# EAGLE design osh_bga_test (EAGLE 8.0.0)

## Sheet 1 of 4
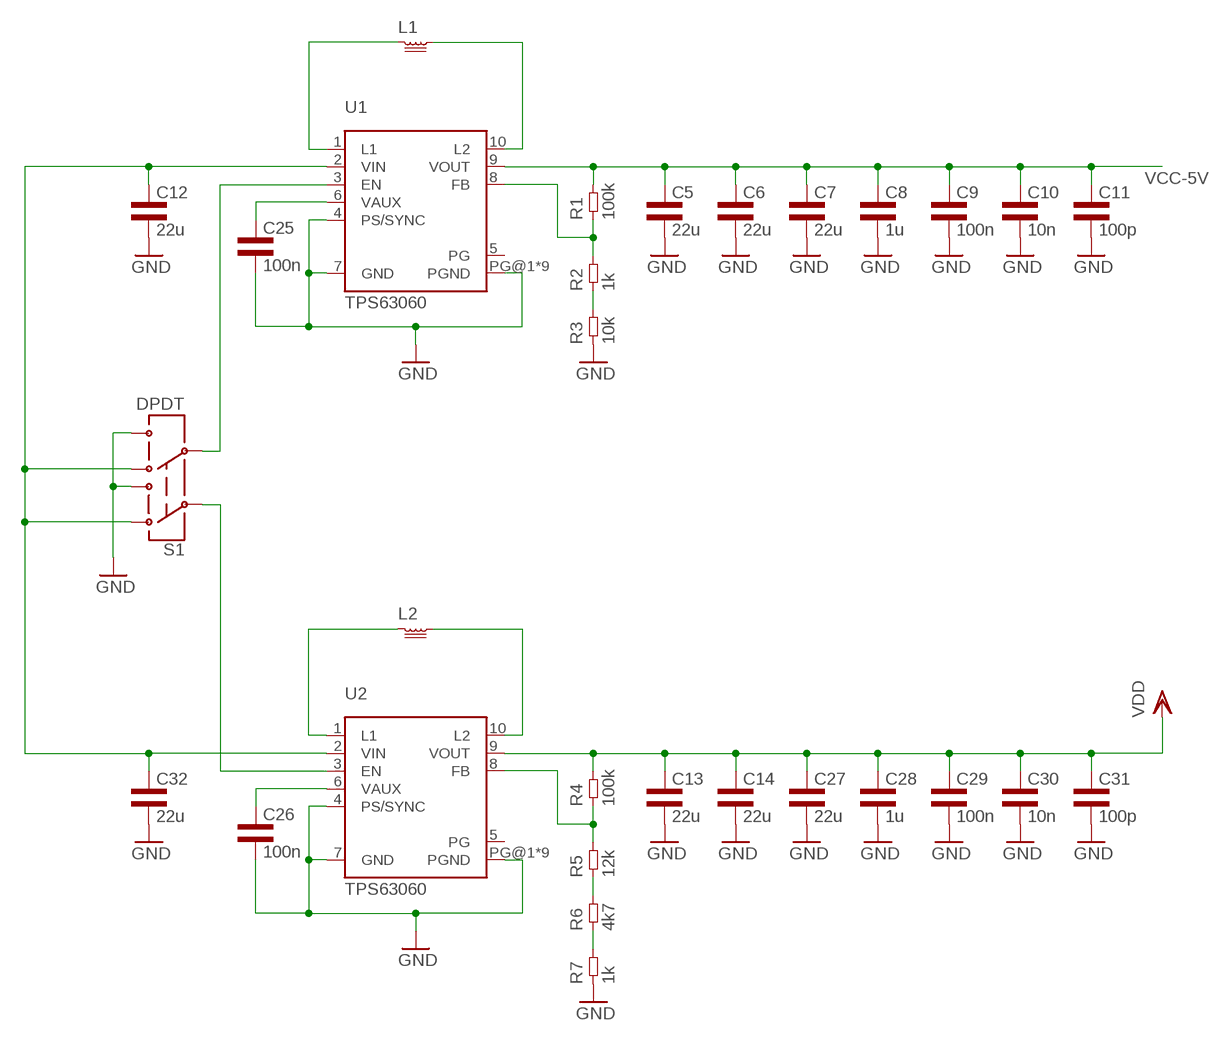
[diagram p0: schematic, sheet 1]

### Parts
C5  22u  CAP1206L3  [1206L3]
C6  22u  CAP1206L3  [1206L3]
C7  22u  CAP1206L3  [1206L3]
C8  1u  CAP0805L3  [0805L3]
C9  100n  CAP0603L3  [0603L3]
C10  10n  CAP0603L3  [0603L3]
C11  100p  CAP0603L3  [0603L3]
C12  22u  CAP1206L3  [1206L3]
C13  22u  CAP1206L3  [1206L3]
C14  22u  CAP1206L3  [1206L3]
C25  100n  CAP0603L3  [0603L3]
C26  100n  CAP0603L3  [0603L3]
C27  22u  CAP1206L3  [1206L3]
C28  1u  CAP0805L3  [0805L3]
C29  100n  CAP0603L3  [0603L3]
C30  10n  CAP0603L3  [0603L3]
C31  100p  CAP0603L3  [0603L3]
C32  22u  CAP1206L3  [1206L3]
L1  INDUCTORSRP4020  [SRP4020]
L2  INDUCTORSRP4020  [SRP4020]
R1  100k  RES0603L3  [0603L3]
R2  1k  RES0603L3  [0603L3]
R3  10k  RES0603L3  [0603L3]
R4  100k  RES0603L3  [0603L3]
R5  12k  RES0603L3  [0603L3]
R6  4k7  RES0603L3  [0603L3]
R7  1k  RES0603L3  [0603L3]
S1  DPDT  SWITCH-DPDTAYZ0202  [AYZ0202]
U1  TPS63060  [S-PWSON-N10]
U2  TPS63060  [S-PWSON-N10]

### Nets
GND: C5.2 C6.2 C7.2 C8.2 C9.P$2 C10.P$2 C11.P$2 C12.2 C13.2 C14.2 C25.P$2 C26.P$2 C27.2 C28.2 C29.P$2 C30.P$2 C31.P$2 C32.2 R3.P$1 R7.P$1 S1.3 S1.6 U1.4(PS/SYNC) U1.7(GND) U1.PG@1(PGND) U1.PG@2(PGND) U1.PG@3(PGND) U1.PG@4(PGND) U1.PG@5(PGND) U1.PG@6(PGND) U1.PG@7(PGND) U1.PG@8(PGND) U1.PG@9(PGND) U2.4(PS/SYNC) U2.7(GND) U2.PG@1(PGND) U2.PG@2(PGND) U2.PG@3(PGND) U2.PG@4(PGND) U2.PG@5(PGND) U2.PG@6(PGND) U2.PG@7(PGND) U2.PG@8(PGND) U2.PG@9(PGND) ; also sheet 2,3
N$1: L1.1 U1.1(L1)
N$2: L1.2 U1.10(L2)
N$3: R1.P$1 R2.P$2 U1.8(FB)
N$4: S1.5 U1.3(EN)
N$5: L2.1 U2.1(L1)
N$6: L2.2 U2.10(L2)
N$7: S1.2 U2.3(EN)
N$8: R2.P$1 R3.P$2
N$9: R4.P$1 R5.P$2 U2.8(FB)
N$10: R5.P$1 R6.P$2
N$11: R6.P$1 R7.P$2
N$12: C25.P$1 U1.6(VAUX)
N$13: C26.P$1 U2.6(VAUX)
VBAT: C12.1 C32.1 S1.1 S1.4 U1.2(VIN) U2.2(VIN)
VCC-5V: C5.1 C6.1 C7.1 C8.1 C9.P$1 C10.P$1 C11.P$1 R1.P$2 U1.9(VOUT)
VDD: C13.1 C14.1 C27.1 C28.1 C29.P$1 C30.P$1 C31.P$1 R4.P$2 U2.9(VOUT) ; also sheet 2,3
Unconnected: U1.5(PG) U2.5(PG)

## Sheet 2 of 4
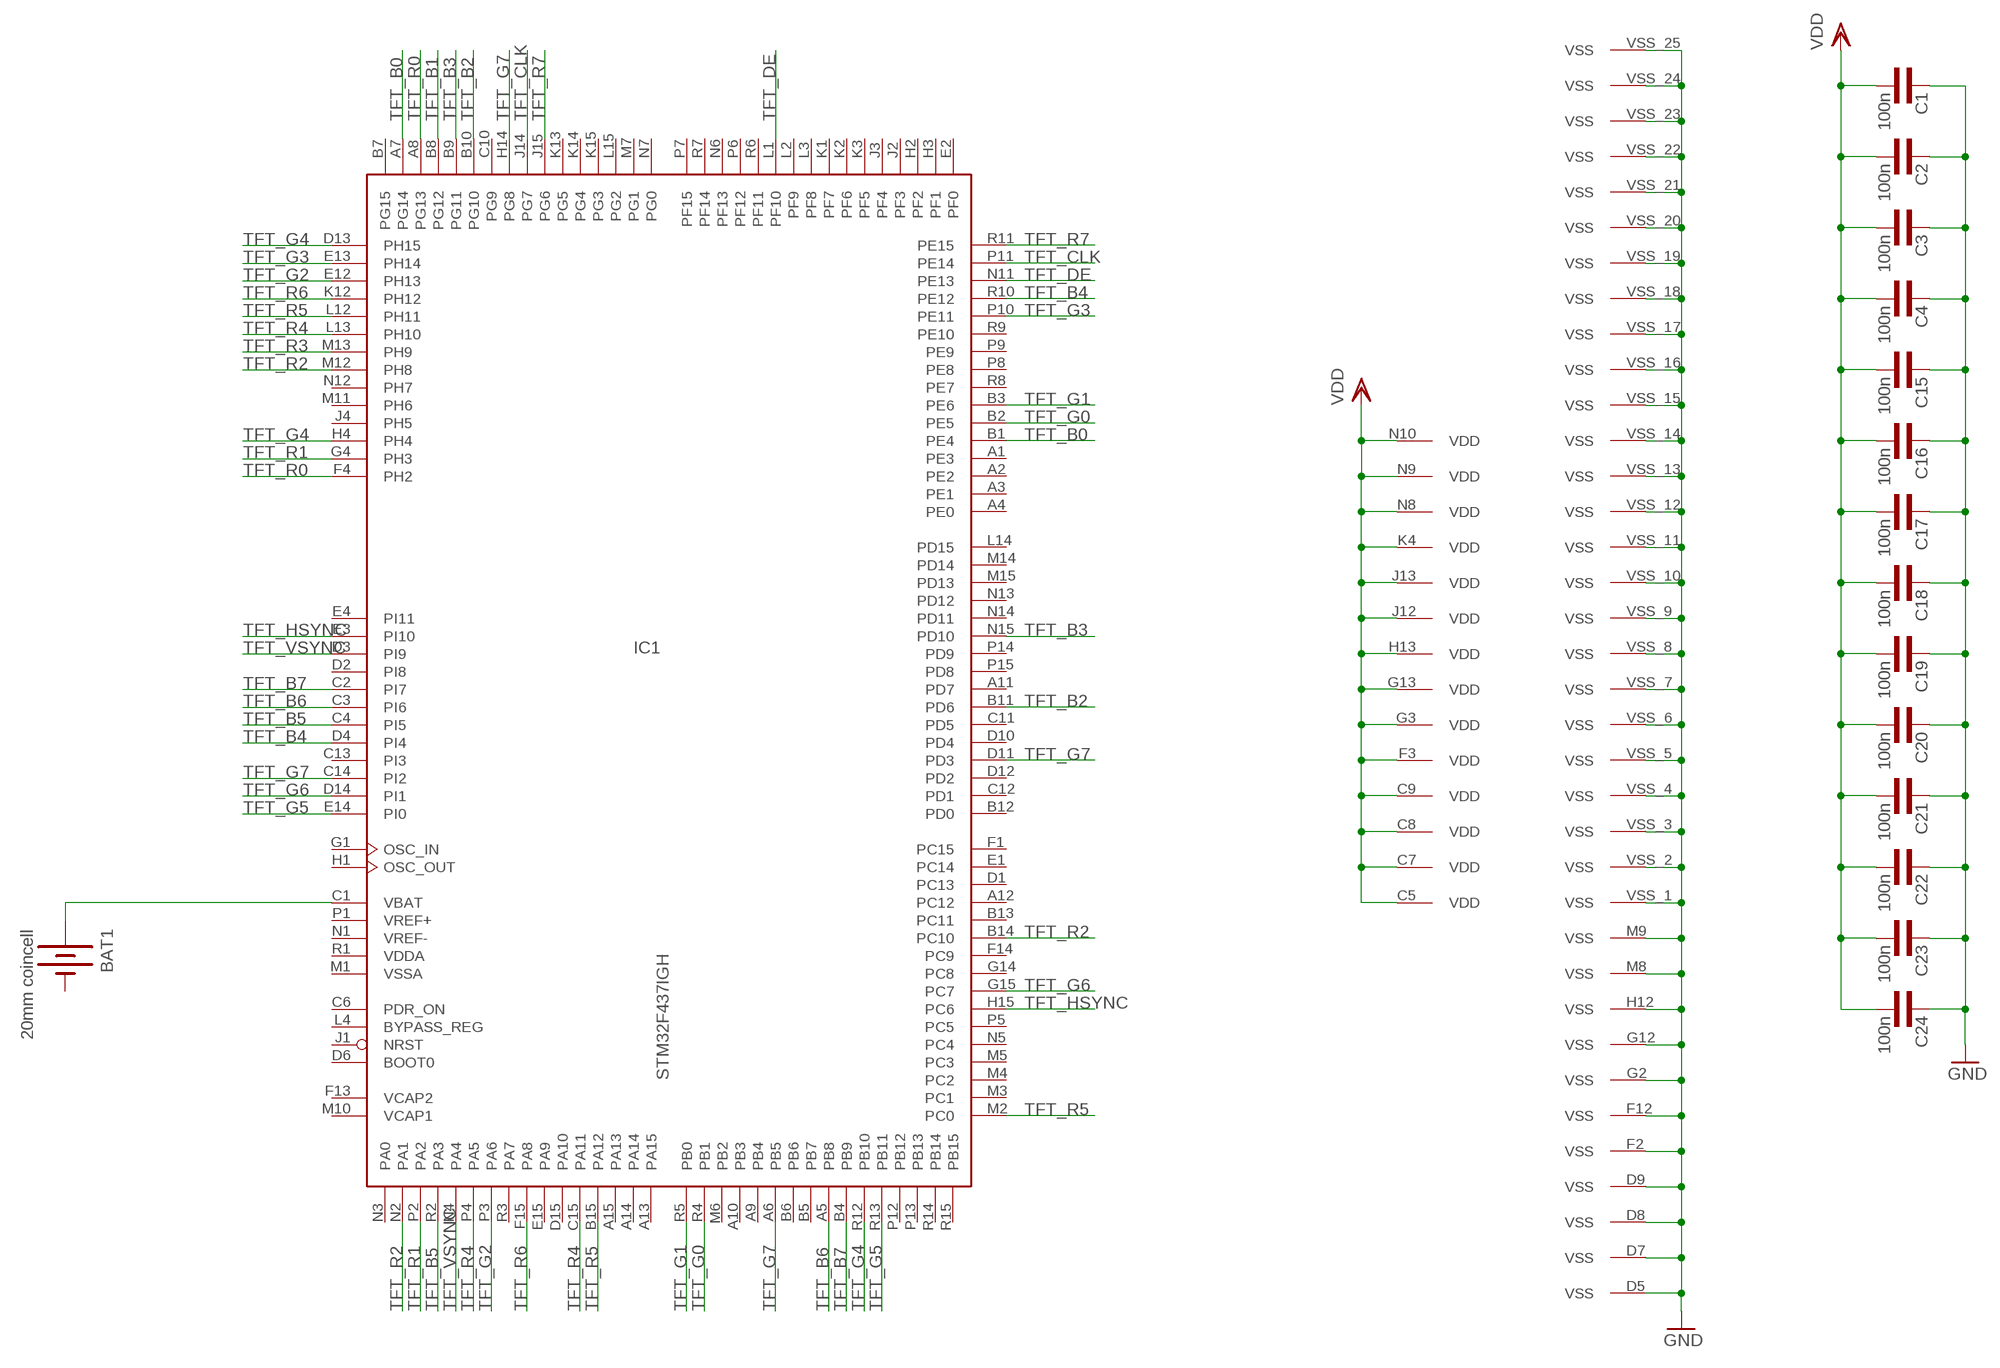
[diagram p1: schematic, sheet 2]

### Parts
BAT1  20mm coincell  BATTERY20MM_4LEGS  [BATTCON_20MM_4LEGS]
C1  100n  CAP0402L3  [0402L3]
C2  100n  CAP0402L3  [0402L3]
C3  100n  CAP0402L3  [0402L3]
C4  100n  CAP0402L3  [0402L3]
C15  100n  CAP0402L3  [0402L3]
C16  100n  CAP0402L3  [0402L3]
C17  100n  CAP0402L3  [0402L3]
C18  100n  CAP0402L3  [0402L3]
C19  100n  CAP0402L3  [0402L3]
C20  100n  CAP0402L3  [0402L3]
C21  100n  CAP0402L3  [0402L3]
C22  100n  CAP0402L3  [0402L3]
C23  100n  CAP0402L3  [0402L3]
C24  100n  CAP0402L3  [0402L3]
IC1  STM32F437IGH  [UFBGA176+25]

### Nets
GND: C1.P$1 C2.P$1 C3.P$1 C4.P$1 C15.P$1 C16.P$1 C17.P$1 C18.P$1 C19.P$1 C20.P$1 C21.P$1 C22.P$1 C23.P$1 C24.P$1 IC1.D5(VSS) IC1.D7(VSS) IC1.D8(VSS) IC1.D9(VSS) IC1.F2(VSS) IC1.F12(VSS) IC1.G2(VSS) IC1.G12(VSS) IC1.H12(VSS) IC1.M8(VSS) IC1.M9(VSS) IC1.VSS_1(VSS) IC1.VSS_2(VSS) IC1.VSS_3(VSS) IC1.VSS_4(VSS) IC1.VSS_5(VSS) IC1.VSS_6(VSS) IC1.VSS_7(VSS) IC1.VSS_8(VSS) IC1.VSS_9(VSS) IC1.VSS_10(VSS) IC1.VSS_11(VSS) IC1.VSS_12(VSS) IC1.VSS_13(VSS) IC1.VSS_14(VSS) IC1.VSS_15(VSS) IC1.VSS_16(VSS) IC1.VSS_17(VSS) IC1.VSS_18(VSS) IC1.VSS_19(VSS) IC1.VSS_20(VSS) IC1.VSS_21(VSS) IC1.VSS_22(VSS) IC1.VSS_23(VSS) IC1.VSS_24(VSS) IC1.VSS_25(VSS) ; also sheet 1,3
N$14: BAT1.1(+) IC1.C1(VBAT)
TFT_B0: IC1.A7(PG14) IC1.B1(PE4) ; also sheet 3
TFT_B1: IC1.B8(PG12) ; also sheet 3
TFT_B2: IC1.B10(PG10) IC1.B11(PD6) ; also sheet 3
TFT_B3: IC1.B9(PG11) IC1.N15(PD10) ; also sheet 3
TFT_B4: IC1.D4(PI4) IC1.R10(PE12) ; also sheet 3
TFT_B5: IC1.C4(PI5) IC1.R2(PA3) ; also sheet 3
TFT_B6: IC1.A5(PB8) IC1.C3(PI6) ; also sheet 3
TFT_B7: IC1.B4(PB9) IC1.C2(PI7) ; also sheet 3
TFT_CLK: IC1.J14(PG7) IC1.P11(PE14) ; also sheet 3
TFT_DE: IC1.L1(PF10) IC1.N11(PE13) ; also sheet 3
TFT_G0: IC1.B2(PE5) IC1.R4(PB1) ; also sheet 3
TFT_G1: IC1.B3(PE6) IC1.R5(PB0) ; also sheet 3
TFT_G2: IC1.E12(PH13) IC1.P3(PA6) ; also sheet 3
TFT_G3: IC1.E13(PH14) IC1.P10(PE11) ; also sheet 3
TFT_G4: IC1.D13(PH15) IC1.H4 IC1.R12(PB10) ; also sheet 3
TFT_G5: IC1.E14(PI0) IC1.R13(PB11) ; also sheet 3
TFT_G6: IC1.D14(PI1) IC1.G15(PC7) ; also sheet 3
TFT_G7: IC1.A6(PB5) IC1.C14(PI2) IC1.D11(PD3) IC1.H14(PG8) ; also sheet 3
TFT_HSYNC: IC1.E3(PI10) IC1.H15(PC6) ; also sheet 3
TFT_R0: IC1.A8(PG13) IC1.F4(PH2) ; also sheet 3
TFT_R1: IC1.G4(PH3) IC1.P2(PA2) ; also sheet 3
TFT_R2: IC1.B14(PC10) IC1.M12(PH8) IC1.N2(PA1) ; also sheet 3
TFT_R3: IC1.M13(PH9) ; also sheet 3
TFT_R4: IC1.C15(PA11) IC1.L13(PH10) IC1.P4(PA5) ; also sheet 3
TFT_R5: IC1.B15(PA12) IC1.L12(PH11) IC1.M2(PC0) ; also sheet 3
TFT_R6: IC1.F15(PA8) IC1.K12(PH12) ; also sheet 3
TFT_R7: IC1.J15(PG6) IC1.R11(PE15) ; also sheet 3
TFT_VSYNC: IC1.D3(PI9) IC1.N4(PA4) ; also sheet 3
VDD: C1.P$2 C2.P$2 C3.P$2 C4.P$2 C15.P$2 C16.P$2 C17.P$2 C18.P$2 C19.P$2 C20.P$2 C21.P$2 C22.P$2 C23.P$2 C24.P$2 IC1.C5(VDD) IC1.C7(VDD) IC1.C8(VDD) IC1.C9(VDD) IC1.F3(VDD) IC1.G3(VDD) IC1.G13(VDD) IC1.H13(VDD) IC1.J12(VDD) IC1.J13(VDD) IC1.K4(VDD) IC1.N8(VDD) IC1.N9(VDD) IC1.N10(VDD) ; also sheet 1,3
Unconnected: IC1.A1(PE3) IC1.A2(PE2) IC1.A3(PE1) IC1.A4(PE0) IC1.A9(PB4) IC1.A10(PB3) IC1.A11(PD7) IC1.A12(PC12) IC1.A13(PA15) IC1.A14 IC1.A15(PA13) IC1.B5(PB7) IC1.B6 IC1.B7(PG15) IC1.B12(PD0) IC1.B13(PC11) IC1.C6(PDR_ON) IC1.C10(PG9) IC1.C11(PD5) IC1.C12(PD1) IC1.C13(PI3) IC1.D1(PC13) IC1.D2(PI8) IC1.D6(BOOT0) IC1.D10(PD4) IC1.D12(PD2) IC1.D15(PA10) IC1.E1(PC14) IC1.E2(PF0) IC1.E4(PI11) IC1.E15(PA9) IC1.F1(PC15) IC1.F14(PC9) IC1.G1(OSC_IN) IC1.G14(PC8) IC1.H1(OSC_OUT) IC1.H2(PF2) IC1.H3(PF1) IC1.J1(NRST) IC1.J2(PF3) IC1.J3(PF4) IC1.J4(PH5) IC1.K1(PF7) IC1.K2(PF6) IC1.K3(PF5) IC1.K13(PG5) IC1.K14(PG4) IC1.K15(PG3) IC1.L2(PF9) IC1.L3(PF8) IC1.L4(BYPASS_REG) IC1.L14(PD15) IC1.L15(PG2) IC1.M3(PC1) IC1.M4(PC2) IC1.M5(PC3) IC1.M6(PB2) IC1.M7(PG1) IC1.M11(PH6) IC1.M14(PD14) IC1.M15(PD13) IC1.N3(PA0) IC1.N5(PC4) IC1.N6(PF13) IC1.N7(PG0) IC1.N12(PH7) IC1.N13(PD12) IC1.N14(PD11) IC1.P5(PC5) IC1.P6(PF12) IC1.P7(PF15) IC1.P8(PE8) IC1.P9(PE9) IC1.P12(PB12) IC1.P13(PB13) IC1.P14(PD9) IC1.P15(PD8) IC1.R3(PA7) IC1.R6(PF11) IC1.R7(PF14) IC1.R8(PE7) IC1.R9(PE10) IC1.R14(PB14) IC1.R15(PB15)

## Sheet 3 of 4: TFT
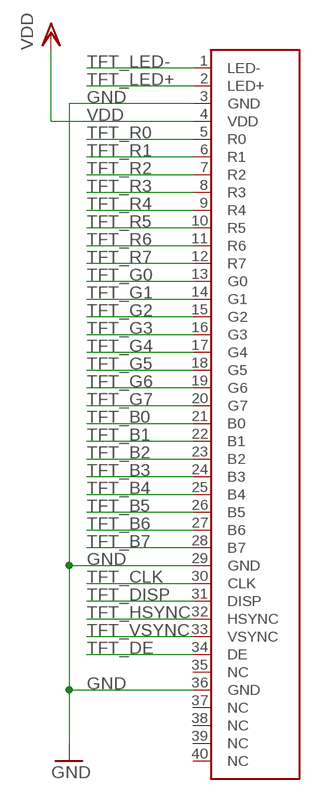
[diagram p2: schematic, sheet 3]

### Parts
CON1  NH-4.3  [FPC-40]

### Nets
GND: CON1.3(GND) CON1.29(GND) CON1.36(GND) ; also sheet 1,2
TFT_B0: CON1.21(B0) ; also sheet 2
TFT_B1: CON1.22(B1) ; also sheet 2
TFT_B2: CON1.23(B2) ; also sheet 2
TFT_B3: CON1.24(B3) ; also sheet 2
TFT_B4: CON1.25(B4) ; also sheet 2
TFT_B5: CON1.26(B5) ; also sheet 2
TFT_B6: CON1.27(B6) ; also sheet 2
TFT_B7: CON1.28(B7) ; also sheet 2
TFT_CLK: CON1.30(CLK) ; also sheet 2
TFT_DE: CON1.34(DE) ; also sheet 2
TFT_DISP: CON1.31(DISP)
TFT_G0: CON1.13(G0) ; also sheet 2
TFT_G1: CON1.14(G1) ; also sheet 2
TFT_G2: CON1.15(G2) ; also sheet 2
TFT_G3: CON1.16(G3) ; also sheet 2
TFT_G4: CON1.17(G4) ; also sheet 2
TFT_G5: CON1.18(G5) ; also sheet 2
TFT_G6: CON1.19(G6) ; also sheet 2
TFT_G7: CON1.20(G7) ; also sheet 2
TFT_HSYNC: CON1.32(HSYNC) ; also sheet 2
TFT_LED+: CON1.2(LED+)
TFT_LED-: CON1.1(LED-)
TFT_R0: CON1.5(R0) ; also sheet 2
TFT_R1: CON1.6(R1) ; also sheet 2
TFT_R2: CON1.7(R2) ; also sheet 2
TFT_R3: CON1.8(R3) ; also sheet 2
TFT_R4: CON1.9(R4) ; also sheet 2
TFT_R5: CON1.10(R5) ; also sheet 2
TFT_R6: CON1.11(R6) ; also sheet 2
TFT_R7: CON1.12(R7) ; also sheet 2
TFT_VSYNC: CON1.33(VSYNC) ; also sheet 2
VDD: CON1.4(VDD) ; also sheet 1,2
Unconnected: CON1.35(NC) CON1.37(NC) CON1.38(NC) CON1.39(NC) CON1.40(NC)

## Sheet 4 of 4: JTAG
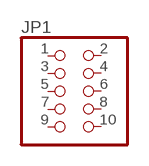
[diagram p3: schematic, sheet 4]

### Parts
JP1  PINHD-2X5  [2X05]
Unconnected: JP1.1 JP1.2 JP1.3 JP1.4 JP1.5 JP1.6 JP1.7 JP1.8 JP1.9 JP1.10

## Power pins joined to a net without a drawn wire
-: BAT1.2(-)
GND: IC1.M10(VCAP1)
VCAP2: IC1.F13(VCAP2)
VDDA: IC1.R1(VDDA)
VREF+: IC1.P1(VREF+)
VREF-: IC1.N1(VREF-)
VSSA: IC1.M1(VSSA)

## Library data of the parts
BAT1 = SparkFun-Electromechanical:BATTERY: Battery Holders Various common sizes : AA, AAA, 20mm coin cell and 12mm coin cell. 20MM_4LEGS, BATT-10373; PROD_ID: BATT-10373
C1-C32 = common:CAP
CON1 = common:NH-4.3
IC1 = micro-stm_v3:STM32F437I*H: ARM 32-bit Cortex™-M3 CPU 180 MHz maximum frequency 1024 to 2048 Kbytes of Flash memory 256 kbytes of SRAM 140 GPIOs 1.8 to 3.6 V application supply
JP1 = pinhead:PINHD-2X5: PIN HEADER
L1 L2 = common:INDUCTOR
R1-R7 = common:RES
S1 = SparkFun-Electromechanical:SWITCH-DPDT: DPDT Version of the COM-00597; PROD_ID: SWCH-08179
U1 U2 = common:TPS63060: Buck-Boost converter with 2A switching current. 2A/1A output current @ 5V Buck, 1.3A @ 5V Boost (Vin > 4V).Auto transition between Buck and Boost. VIN = 2.5V - 12V VOUT = 2.5V - 8V Load disconnect during shutdown Overtemp Protection Overvoltage Protection Fixed Frequency @ 2.4MHz with Sync possible For use in Lithium battery applications; FREQ: 2.4MHz; IOUT_MAX: 2A; VIN_MAX: 12V; VIN_MIN: 2.5V; VOUT_MAX: 8V; VOUT_MIN: 2.5V

## Board
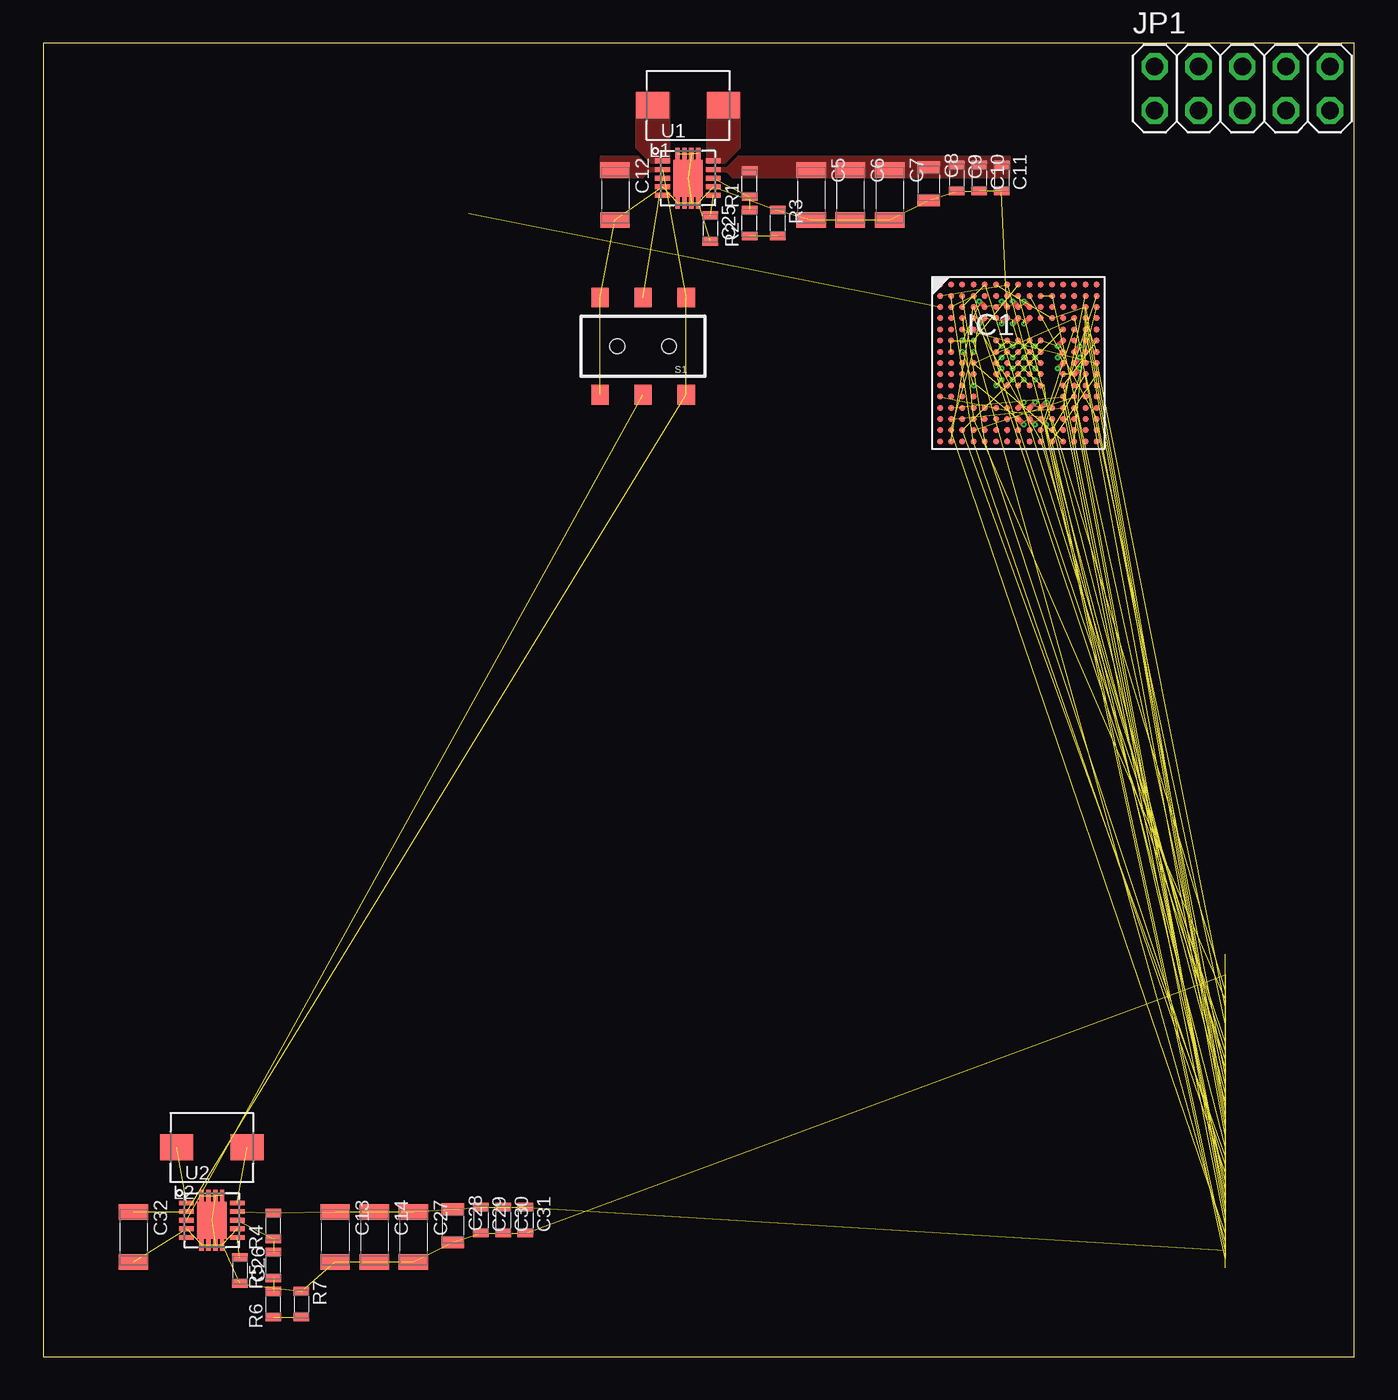
[diagram p4: board, top side]
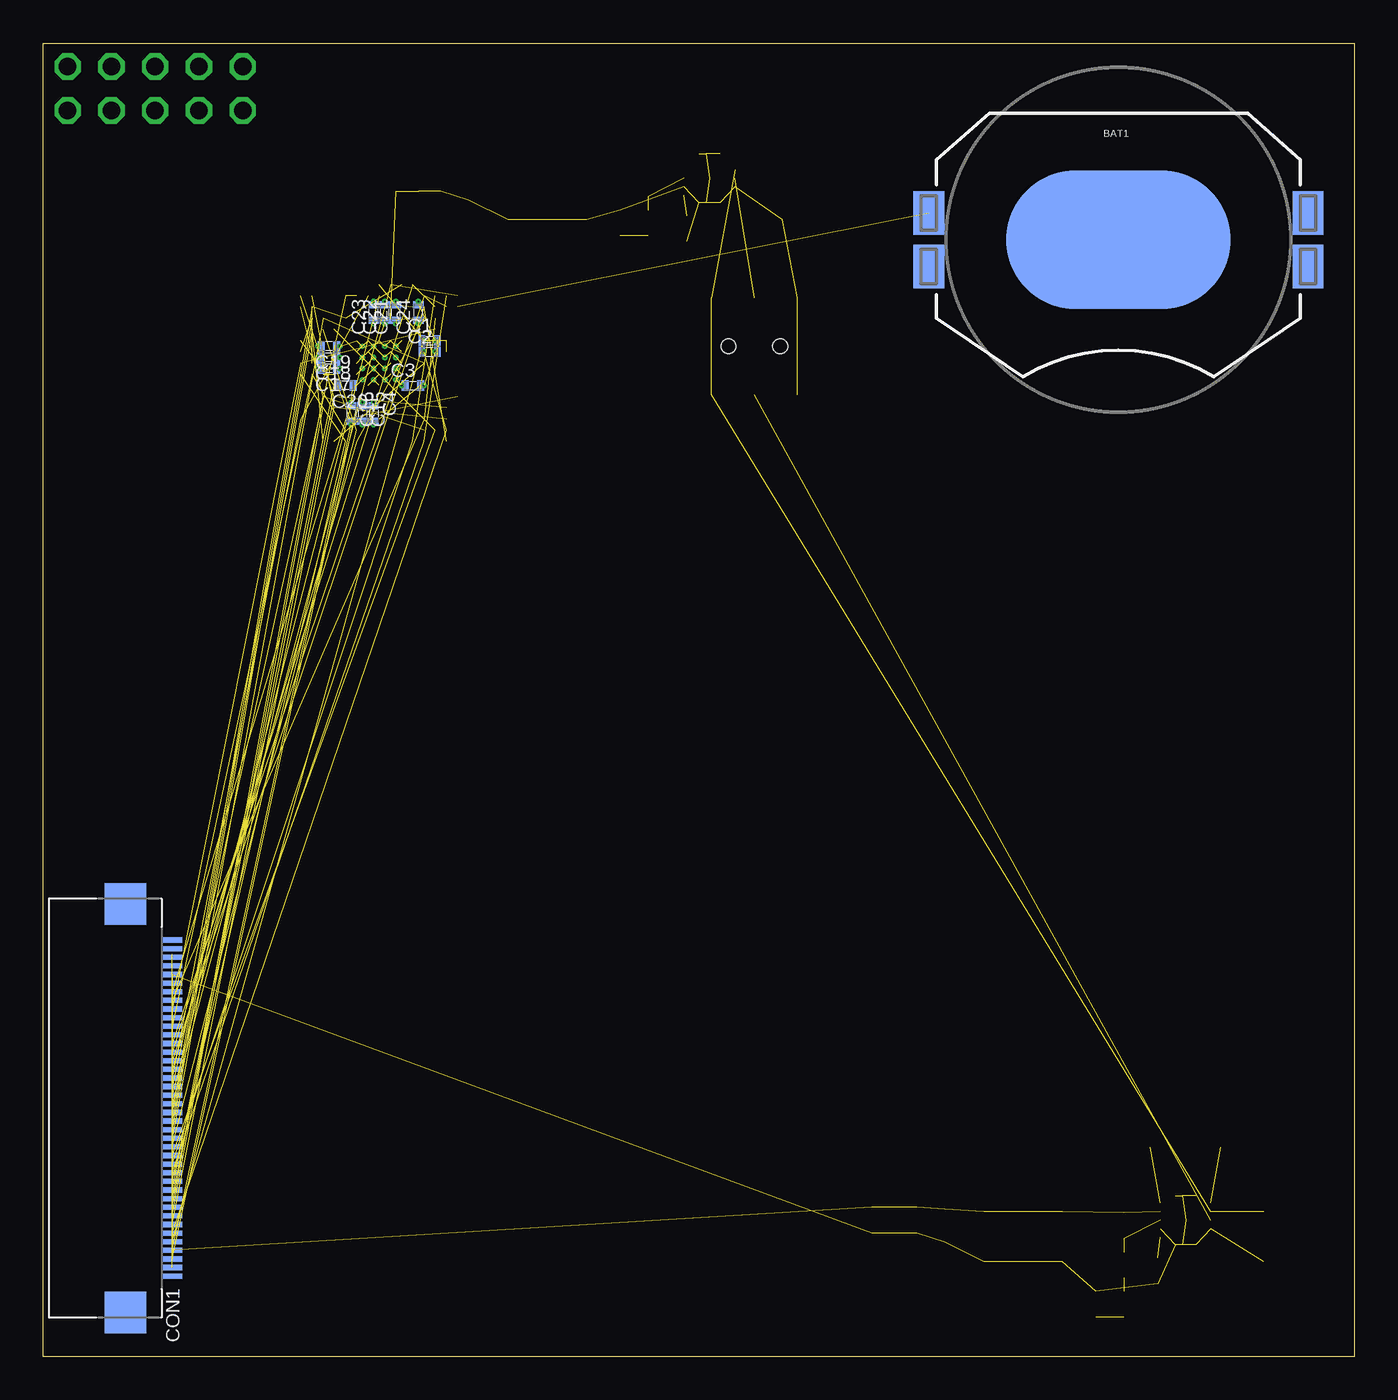
[diagram p5: board, bottom side, seen from below]

Size 76.1 x 76.22 mm. Coordinates in mm from the lower left corner, seen from the top.
Outline: 0,0 76.1,0 76.1,76.22 0,76.22 0,0
Copper layers (1*2*3*16): Top 0.035mm / dielectric 1.5mm / Route2 0.035mm / dielectric 0.15mm / Route3 0.035mm / dielectric 0.2mm / Bottom 0.035mm
Design rules "default *": minimum track width 5mil, minimum drill 10mil, track to track 5mil, track to pad 5mil, pad to pad 5mil, via to via 5mil, smd to smd 0mil, copper to edge 13mil, drill to drill 5mil, minimum pad ring 4mil, minimum via ring 4mil, stop-mask expansion 4mil, vias tented up to drill 0mil, thermal gap 10mil

### Footprints (pad centres in the part's own frame; a part is rotated, then mirrored left to right if it is on the bottom)
BATTCON_20MM_4LEGS = smd 1.778 x 2.54: 1 -11,1.55; 3 11,1.55; P$1 -11,-1.55; P$2 11,-1.55 | smd 13 x 8: 2 0,0
0402L3 = smd 0.4 x 0.6: P$1 -0.45,0; P$2 0.45,0
1206L3 = smd 0.9 x 1.7: 1 -1.45,0; 2 1.45,0
0805L3 = smd 0.7 x 1.3: 1 -0.95,0; 2 0.95,0
0603L3 = smd 0.5 x 0.9: P$1 -0.75,0; P$2 0.75,0
FPC-40 = smd 0.3 x 1.2: 1 9.75,0; 2 9.25,0; 3 8.75,0; 4 8.25,0; 5 7.75,0; 6 7.25,0; 7 6.75,0; 8 6.25,0; 9 5.75,0; 10 5.25,0; 11 4.75,0; 12 4.25,0; 13 3.75,0; 14 3.25,0; 15 2.75,0; 16 2.25,0; 17 1.75,0; 18 1.25,0; 19 0.75,0; 20 0.25,0; 21 -0.25,0; 22 -0.75,0; 23 -1.25,0; 24 -1.75,0; 25 -2.25,0; 26 -2.75,0; 27 -3.25,0; 28 -3.75,0; 29 -4.25,0; 30 -4.75,0; 31 -5.25,0; 32 -5.75,0; 33 -6.25,0; 34 -6.75,0; 35 -7.25,0; 36 -7.75,0; 37 -8.25,0; 38 -8.75,0; 39 -9.25,0; 40 -9.75,0 | smd 2.4 x 2.4: NAIL@1 -11.85,-2.7; NAIL@2 11.85,-2.7
UFBGA176+25 = smd 0.35 x 0.35: A1 -4.55,4.55; A2 -3.9,4.55; A3 -3.25,4.55; A4 -2.6,4.55; A5 -1.95,4.55; A6 -1.3,4.55; A7 -0.65,4.55; A8 0,4.55; A9 0.65,4.55; A10 1.3,4.55; A11 1.95,4.55; A12 2.6,4.55; A13 3.25,4.55; A14 3.9,4.55; A15 4.55,4.55; B1 -4.55,3.9; B2 -3.9,3.9; B3 -3.25,3.9; B4 -2.6,3.9; B5 -1.95,3.9; B6 -1.3,3.9; B7 -0.65,3.9; B8 0,3.9; B9 0.65,3.9; B10 1.3,3.9; B11 1.95,3.9; B12 2.6,3.9; B13 3.25,3.9; B14 3.9,3.9; B15 4.55,3.9; C1 -4.55,3.25; C2 -3.9,3.25; C3 -3.25,3.25; C4 -2.6,3.25; C5 -1.95,3.25; C6 -1.3,3.25; C7 -0.65,3.25; C8 0,3.25; C9 0.65,3.25; C10 1.3,3.25; C11 1.95,3.25; C12 2.6,3.25; C13 3.25,3.25; C14 3.9,3.25; C15 4.55,3.25; D1 -4.55,2.6; D2 -3.9,2.6; D3 -3.25,2.6; D4 -2.6,2.6; D5 -1.95,2.6; D6 -1.3,2.6; D7 -0.65,2.6; D8 0,2.6; D9 0.65,2.6; D10 1.3,2.6; D11 1.95,2.6; D12 2.6,2.6; D13 3.25,2.6; D14 3.9,2.6; D15 4.55,2.6; E1 -4.55,1.95; E2 -3.9,1.95; E3 -3.25,1.95; E4 -2.6,1.95; E12 2.6,1.95; E13 3.25,1.95; E14 3.9,1.95; E15 4.55,1.95; F1 -4.55,1.3; F2 -3.9,1.3; F3 -3.25,1.3; F4 -2.6,1.3; F12 2.6,1.3; F13 3.25,1.3; F14 3.9,1.3; F15 4.55,1.3; G1 -4.55,0.65; G2 -3.9,0.65; G3 -3.25,0.65; G4 -2.6,0.65; G12 2.6,0.65; G13 3.25,0.65; G14 3.9,0.65; G15 4.55,0.65; H1 -4.55,0; H2 -3.9,0; H3 -3.25,0; H4 -2.6,0; H12 2.6,0; H13 3.25,0; H14 3.9,0; H15 4.55,0; J1 -4.55,-0.65; J2 -3.9,-0.65; J3 -3.25,-0.65; J4 -2.6,-0.65; J12 2.6,-0.65; J13 3.25,-0.65; J14 3.9,-0.65; J15 4.55,-0.65; K1 -4.55,-1.3; K2 -3.9,-1.3; K3 -3.25,-1.3; K4 -2.6,-1.3; K12 2.6,-1.3; K13 3.25,-1.3; K14 3.9,-1.3; K15 4.55,-1.3; L1 -4.55,-1.95; L2 -3.9,-1.95; L3 -3.25,-1.95; L4 -2.6,-1.95; L12 2.6,-1.95; L13 3.25,-1.95; L14 3.9,-1.95; L15 4.55,-1.95; M1 -4.55,-2.6; M2 -3.9,-2.6; M3 -3.25,-2.6; M4 -2.6,-2.6; M5 -1.95,-2.6; M6 -1.3,-2.6; M7 -0.65,-2.6; M8 0,-2.6; M9 0.65,-2.6; M10 1.3,-2.6; M11 1.95,-2.6; M12 2.6,-2.6; M13 3.25,-2.6; M14 3.9,-2.6; M15 4.55,-2.6; N1 -4.55,-3.25; N2 -3.9,-3.25; N3 -3.25,-3.25; N4 -2.6,-3.25; N5 -1.95,-3.25; N6 -1.3,-3.25; N7 -0.65,-3.25; N8 0,-3.25; N9 0.65,-3.25; N10 1.3,-3.25; N11 1.95,-3.25; N12 2.6,-3.25; N13 3.25,-3.25; N14 3.9,-3.25; N15 4.55,-3.25; P1 -4.55,-3.9; P2 -3.9,-3.9; P3 -3.25,-3.9; P4 -2.6,-3.9; P5 -1.95,-3.9; P6 -1.3,-3.9; P7 -0.65,-3.9; P8 0,-3.9; P9 0.65,-3.9; P10 1.3,-3.9; P11 1.95,-3.9; P12 2.6,-3.9; P13 3.25,-3.9; P14 3.9,-3.9; P15 4.55,-3.9; R1 -4.55,-4.55; R2 -3.9,-4.55; R3 -3.25,-4.55; R4 -2.6,-4.55; R5 -1.95,-4.55; R6 -1.3,-4.55; R7 -0.65,-4.55; R8 0,-4.55; R9 0.65,-4.55; R10 1.3,-4.55; R11 1.95,-4.55; R12 2.6,-4.55; R13 3.25,-4.55; R14 3.9,-4.55; R15 4.55,-4.55; VSS_1 -1.3,1.3; VSS_2 -0.65,1.3; VSS_3 0,1.3; VSS_4 0.65,1.3; VSS_5 1.3,1.3; VSS_6 -1.3,0.65; VSS_7 -0.65,0.65; VSS_8 0,0.65; VSS_9 0.65,0.65; VSS_10 1.3,0.65; VSS_11 -1.3,0; VSS_12 -0.65,0; VSS_13 0,0; VSS_14 0.65,0; VSS_15 1.3,0; VSS_16 -1.3,-0.65; VSS_17 -0.65,-0.65; VSS_18 0,-0.65; VSS_19 0.65,-0.65; VSS_20 1.3,-0.65; VSS_21 -1.3,-1.3; VSS_22 -0.65,-1.3; VSS_23 0,-1.3; VSS_24 0.65,-1.3; VSS_25 1.3,-1.3
2X05 = drill 1.016 octagon: 1 -5.08,-1.27; 2 -5.08,1.27; 3 -2.54,-1.27; 4 -2.54,1.27; 5 0,-1.27; 6 0,1.27; 7 2.54,-1.27; 8 2.54,1.27; 9 5.08,-1.27; 10 5.08,1.27
SRP4020 = smd 1.9 x 1.5: 1 -2.05,0; 2 2.05,0
AYZ0202 = smd 1 x 1.15: 1 -2.5,2.825; 2 0,2.825; 3 2.5,2.825; 4 -2.5,-2.825; 5 0,-2.825; 6 2.5,-2.825 | hole 0.85: 1.5,0; -1.5,0
S-PWSON-N10 = smd 0.28 x 0.85: 1 -1,-1.475; 2 -0.5,-1.475; 3 0,-1.475; 4 0.5,-1.475; 5 1,-1.475; 6 1,1.475; 7 0.5,1.475; 8 0,1.475; 9 -0.5,1.475; 10 -1,1.475 | smd 2.15 x 1.7: PG@1 0,0 | smd 0.7 x 0.25: PG@2 -1.425,0.6; PG@3 -1.425,0.2; PG@4 -1.425,-0.2; PG@5 -1.425,-0.6; PG@6 1.425,-0.6; PG@7 1.425,-0.2; PG@8 1.425,0.2; PG@9 1.425,0.6

### Placement (x,y rotation side)
BAT1  13.7,64.81 0 bottom
C1  53.67,58.96 0 bottom
C2  53.67,58.31 0 bottom
C3  54.65,56.36 0 bottom
C4  56.92,54.73 270 bottom
C5  44.57,67.41 270 top
C6  46.85,67.41 270 top
C7  49.12,67.41 270 top
C8  51.4,68.06 270 top
C9  53.02,68.38 270 top
C10  54.32,68.38 270 top
C11  55.62,68.38 270 top
C12  33.2,67.41 270 top
C13  16.95,6.96 270 top
C14  19.22,6.96 270 top
C15  57.57,54.73 270 bottom
C16  58.22,54.73 270 bottom
C17  59.52,57.33 180 bottom
C18  59.52,57.98 180 bottom
C19  59.52,58.63 180 bottom
C20  58.55,56.36 180 bottom
C21  55.62,60.58 90 bottom
C22  56.27,60.58 90 bottom
C23  56.92,60.58 90 bottom
C24  54.32,60.58 90 bottom
C25  38.72,65.46 270 top
C26  11.42,5.01 270 top
C27  21.5,6.96 270 top
C28  23.77,7.61 270 top
C29  25.4,7.93 270 top
C30  26.7,7.93 270 top
C31  28,7.93 270 top
C32  5.25,6.96 270 top
CON1  68.62,14.43 270 bottom
IC1  56.6,57.66 0 top
JP1  69.6,73.58 0 top
L1  37.42,72.61 0 top
L2  9.8,12.16 0 top
R1  41,68.06 90 top
R2  41,65.78 90 top
R3  42.62,65.78 270 top
R4  13.37,7.61 90 top
R5  13.37,5.33 90 top
R6  13.37,3.06 90 top
R7  15,3.06 270 top
S1  34.82,58.63 180 top
U1  37.42,68.38 270 top
U2  9.8,7.93 270 top

### Tracks (layer width: path | path; a pad name or v marks a point on that pad's centre or on a via)
GND  (via drill 0.1)  (106 unrouted)
  Top 0.3: IC1.F12 v58.87,58.63 | v58.87,57.98 IC1.G12 | v58.87,57.33 IC1.H12 | IC1.D9 v56.92,59.93 | IC1.D8 v56.27,59.93 | IC1.D7 v55.62,59.93 | IC1.D5 v54.32,59.93 | IC1.M8 v56.92,55.38 | IC1.M9 v57.57,55.38 | IC1.M10 v58.22,55.38
  Bottom 0.18: 59.2,57.33 C17.P$1 | C3.P$1 IC1.VSS_21
  Bottom 0.3: C19.P$1 v58.87,58.63 | C18.P$1 v58.87,57.98 | C17.P$1 v58.87,57.33 | C4.P$1 v56.92,55.38 | C15.P$1 v57.57,55.38 | C16.P$1 v58.22,55.38
  other vias: 55.62,56.68 56.27,56.68 56.92,56.68 57.57,56.68 57.57,57.33 56.92,57.33 56.27,57.33 55.62,57.33 55.62,57.98 56.27,57.98 56.92,57.98 57.57,57.98 57.57,58.63 56.92,58.63 56.27,58.63 55.62,58.63 55.3,56.36
N$1
  pour Top (no thermals): 36.36,69.26 35.32,69.26 34.42,70.16 34.42,73.35 36.36,73.35
N$2
  pour Top (no thermals): 38.52,69.26 39.55,69.26 40.45,70.16 40.45,73.35 38.56,73.35 38.52,73.35
N$3  (2 unrouted)
N$4  (1 unrouted)
N$5  (1 unrouted)
N$6  (1 unrouted)
N$7  (1 unrouted)
N$8  (1 unrouted)
N$9  (2 unrouted)
N$10  (1 unrouted)
N$11  (1 unrouted)
N$12  (1 unrouted)
N$13  (1 unrouted)
N$14  (1 unrouted)
N$16  (via drill 0.1)
  other vias: 54,58.96
N$17  (via drill 0.1)
  other vias: 54,58.31
TFT_B0  (2 unrouted)
TFT_B1  (1 unrouted)
TFT_B2  (2 unrouted)
TFT_B3  (2 unrouted)
TFT_B4  (2 unrouted)
TFT_B5  (2 unrouted)
TFT_B6  (2 unrouted)
TFT_B7  (2 unrouted)
TFT_CLK  (2 unrouted)
TFT_DE  (2 unrouted)
TFT_G0  (2 unrouted)
TFT_G1  (2 unrouted)
TFT_G2  (2 unrouted)
TFT_G3  (2 unrouted)
TFT_G4  (3 unrouted)
TFT_G5  (2 unrouted)
TFT_G6  (2 unrouted)
TFT_G7  (4 unrouted)
TFT_HSYNC  (2 unrouted)
TFT_LED+  (1 unrouted)
TFT_R0  (2 unrouted)
TFT_R1  (2 unrouted)
TFT_R2  (3 unrouted)
TFT_R3  (1 unrouted)
TFT_R4  (3 unrouted)
TFT_R5  (3 unrouted)
TFT_R6  (2 unrouted)
TFT_R7  (2 unrouted)
TFT_VSYNC  (2 unrouted)
VBAT  (4 unrouted)
  pour Top (no thermals): 36.36,68.99 35.19,68.99 34.51,69.66 32.35,69.66 32.35,68.4 34.78,68.4 35.14,68.76 36.36,68.76
VCC-5V
  pour Top (no thermals): 38.52,68.99 39.69,68.99 40.36,69.66 56.11,69.66 56.11,68.4 40.05,68.4 39.69,68.76 38.52,68.76
VDD  (via drill 0.1)  (24 unrouted)
  Top 0.3: v60.17,58.63 IC1.G13 | v60.17,57.98 IC1.H13 | v60.17,57.33 IC1.J13 | IC1.C5 v54.32,61.23 | IC1.C7 v55.62,61.23 | IC1.C8 v56.27,61.23 | IC1.C9 v56.92,61.23 | IC1.N8 v56.92,54.08 | IC1.N9 v57.57,54.08 | IC1.N10 v58.22,54.08
  Bottom 0.18: C21.P$2 v55.62,61.23 | C22.P$2 v56.27,61.23 | C23.P$2 v56.92,61.23 | C24.P$2 v54.32,61.23 | C1.P$2 IC1.F3 | C2.P$2 IC1.G3 | C3.P$2 v54,56.36
  Bottom 0.3: C19.P$2 v60.17,58.63 | C18.P$2 v60.17,57.98 | C17.P$2 v60.17,57.33 | C16.P$2 v58.22,54.08 | C15.P$2 v57.57,54.08 | C4.P$2 v56.92,54.08
  other vias: 53.35,58.96 53.35,58.31